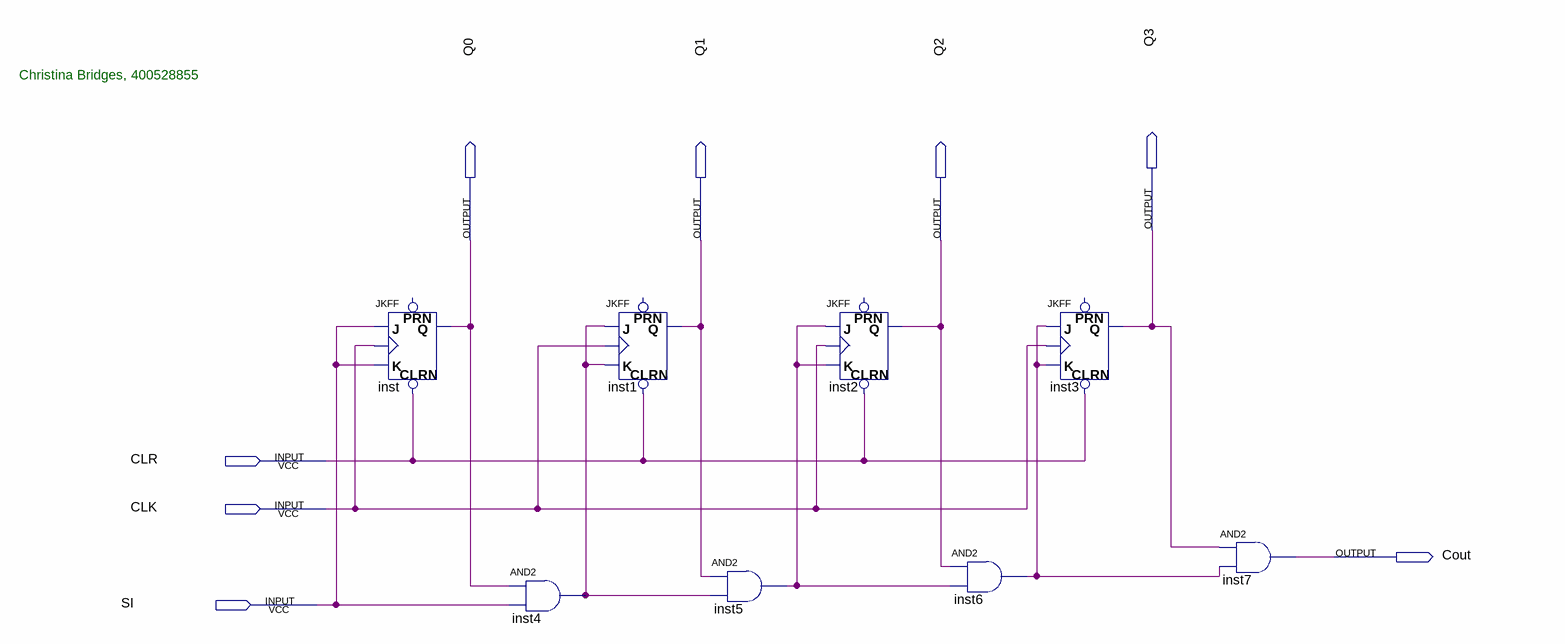
[diagram p0: schematic sheet]
// Quartus schematic lab4_counter.bdf as structural Verilog: 8 symbols, 8 pins
module lab4_counter (
  input  CLR,
  input  CLK,
  input  SI,
  output Q3,
  output Q0,
  output Q1,
  output Q2,
  output Cout
);

  wire inst4_out, inst5_out, inst6_out;

  JKFF inst (.CLRN(CLR), .K(SI), .J(SI), .CLK(CLK), .Q(Q0));  // open: PRN
  and inst4 (inst4_out, Q0, SI);
  JKFF inst1 (.CLRN(CLR), .K(inst4_out), .J(inst4_out), .CLK(CLK), .Q(Q1));  // open: PRN
  and inst5 (inst5_out, Q1, inst4_out);
  JKFF inst2 (.CLRN(CLR), .K(inst5_out), .J(inst5_out), .CLK(CLK), .Q(Q2));  // open: PRN
  and inst6 (inst6_out, Q2, inst5_out);
  JKFF inst3 (.CLRN(CLR), .K(inst6_out), .J(inst6_out), .CLK(CLK), .Q(Q3));  // open: PRN
  and inst7 (Cout, Q3, inst6_out);

  // Notes on the sheet:
  //   Christina Bridges, 400528855
endmodule
